# Altium schematic sheet dram.SchDoc
size A1; SheetNumber: 7; SheetTotal: 21
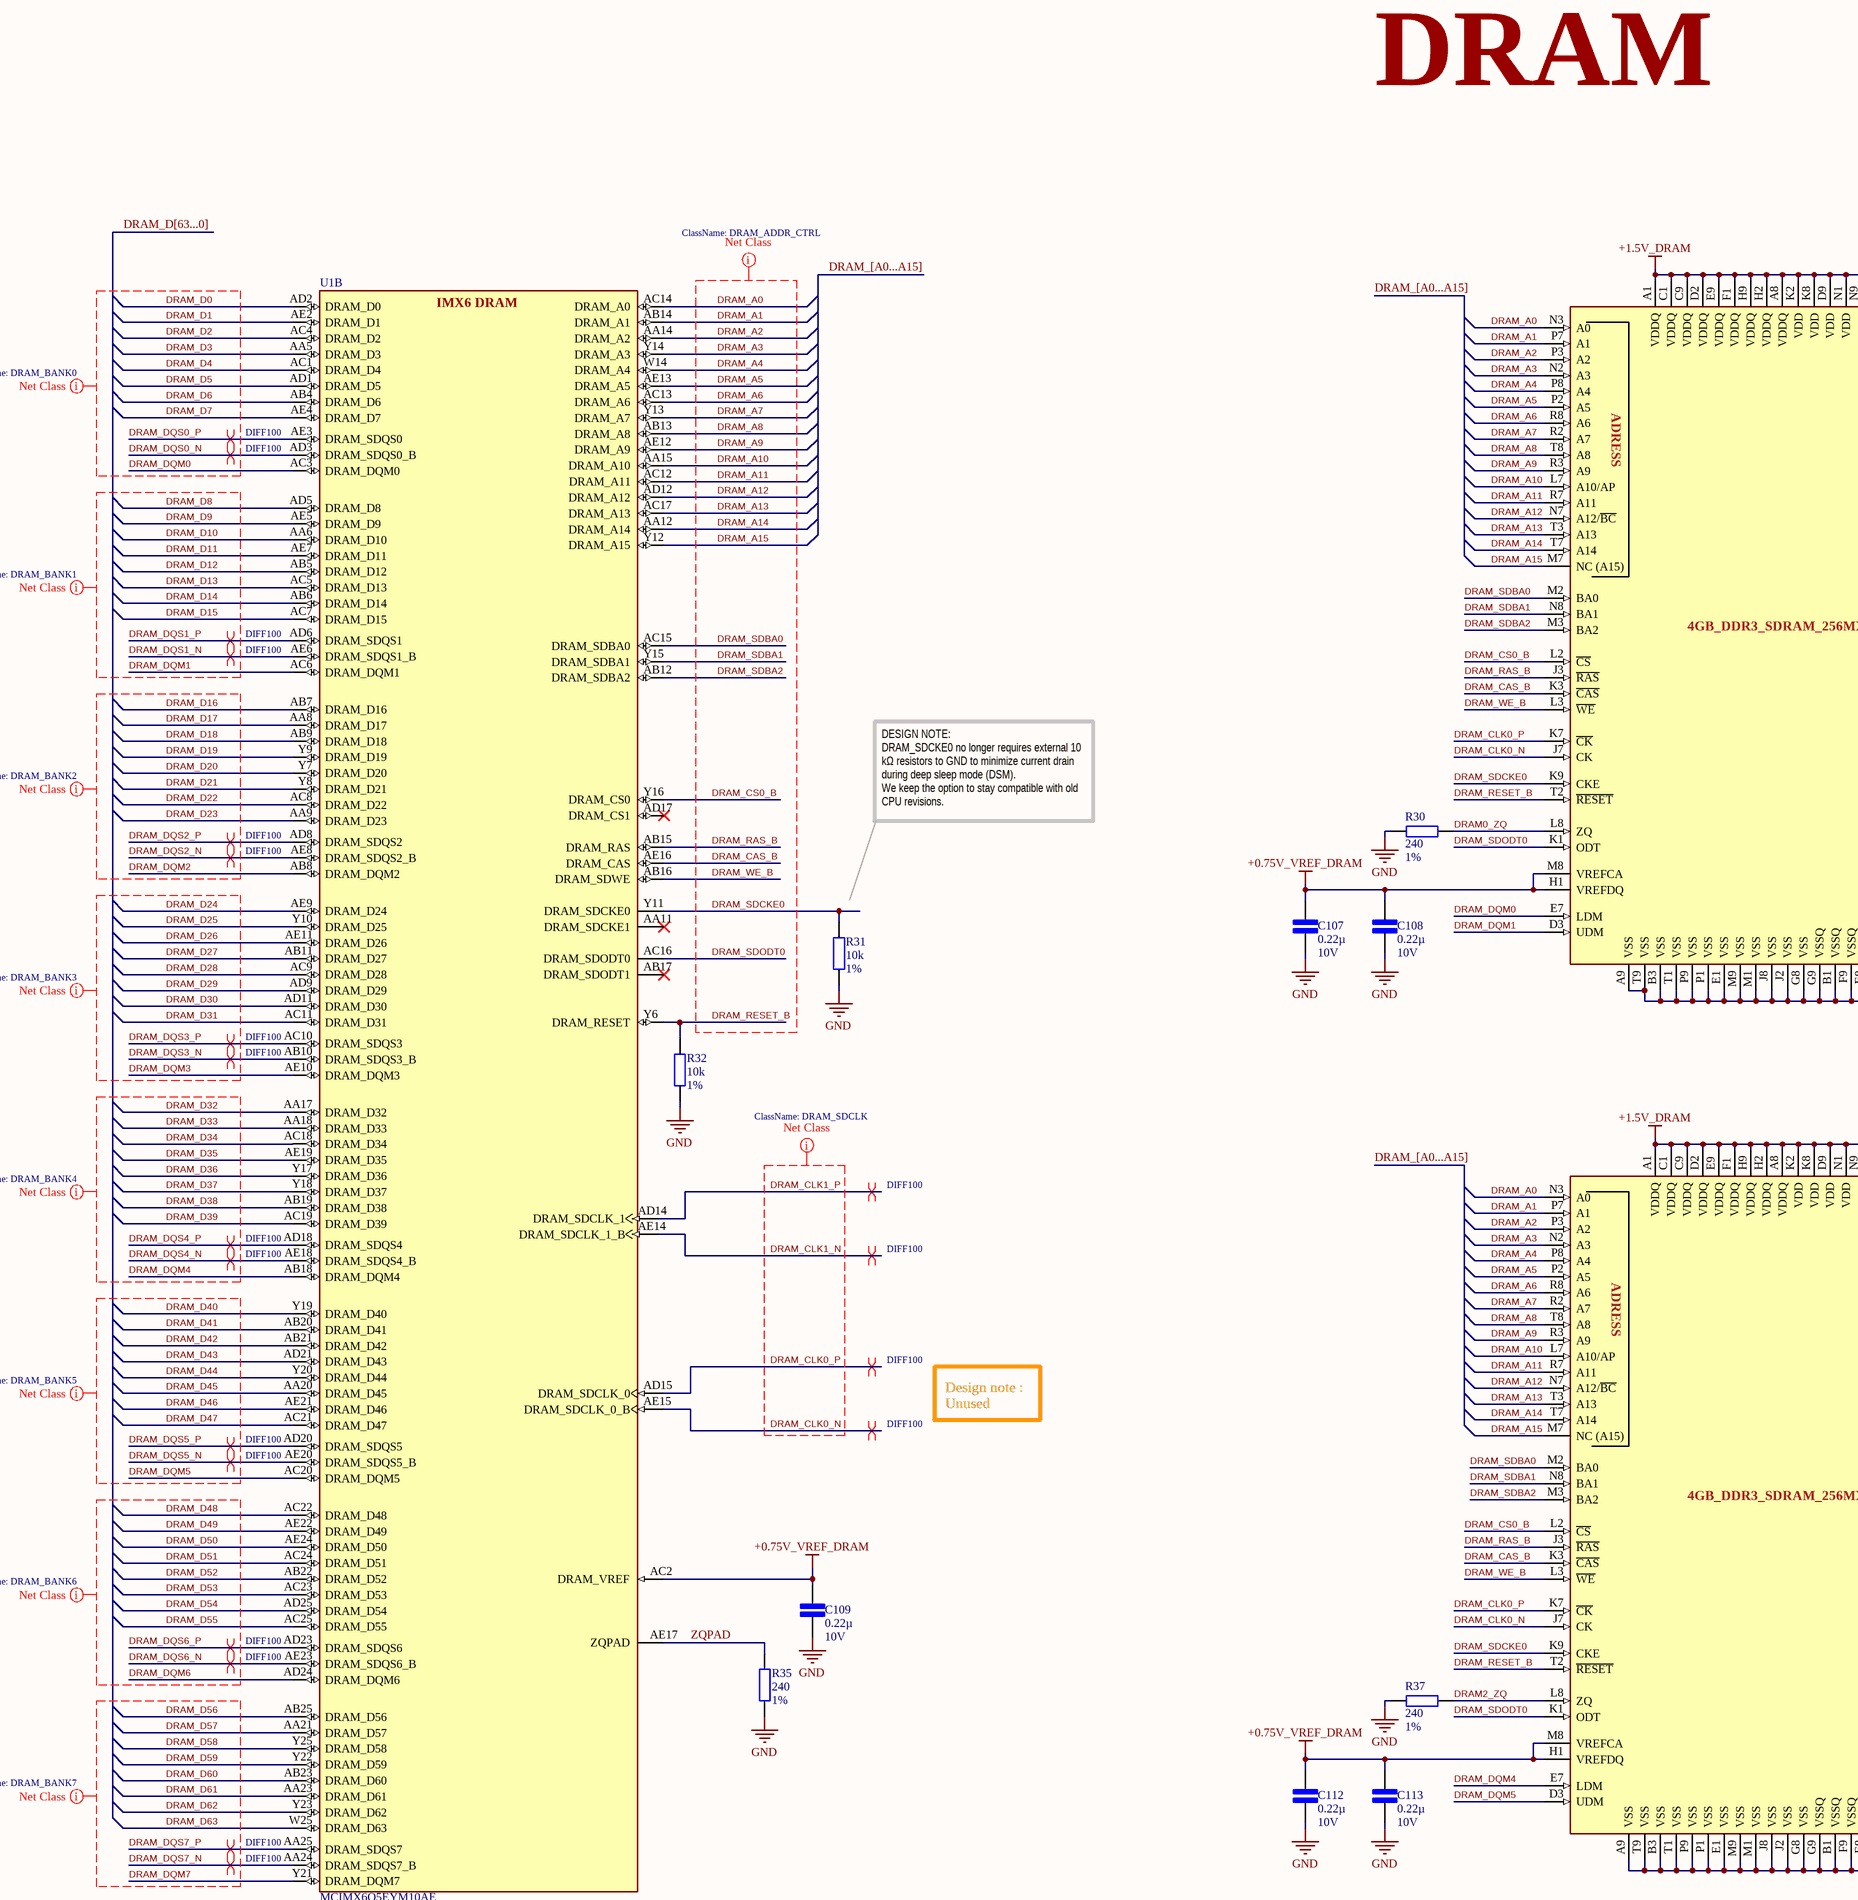
[diagram p0: dram.SchDoc, top left]
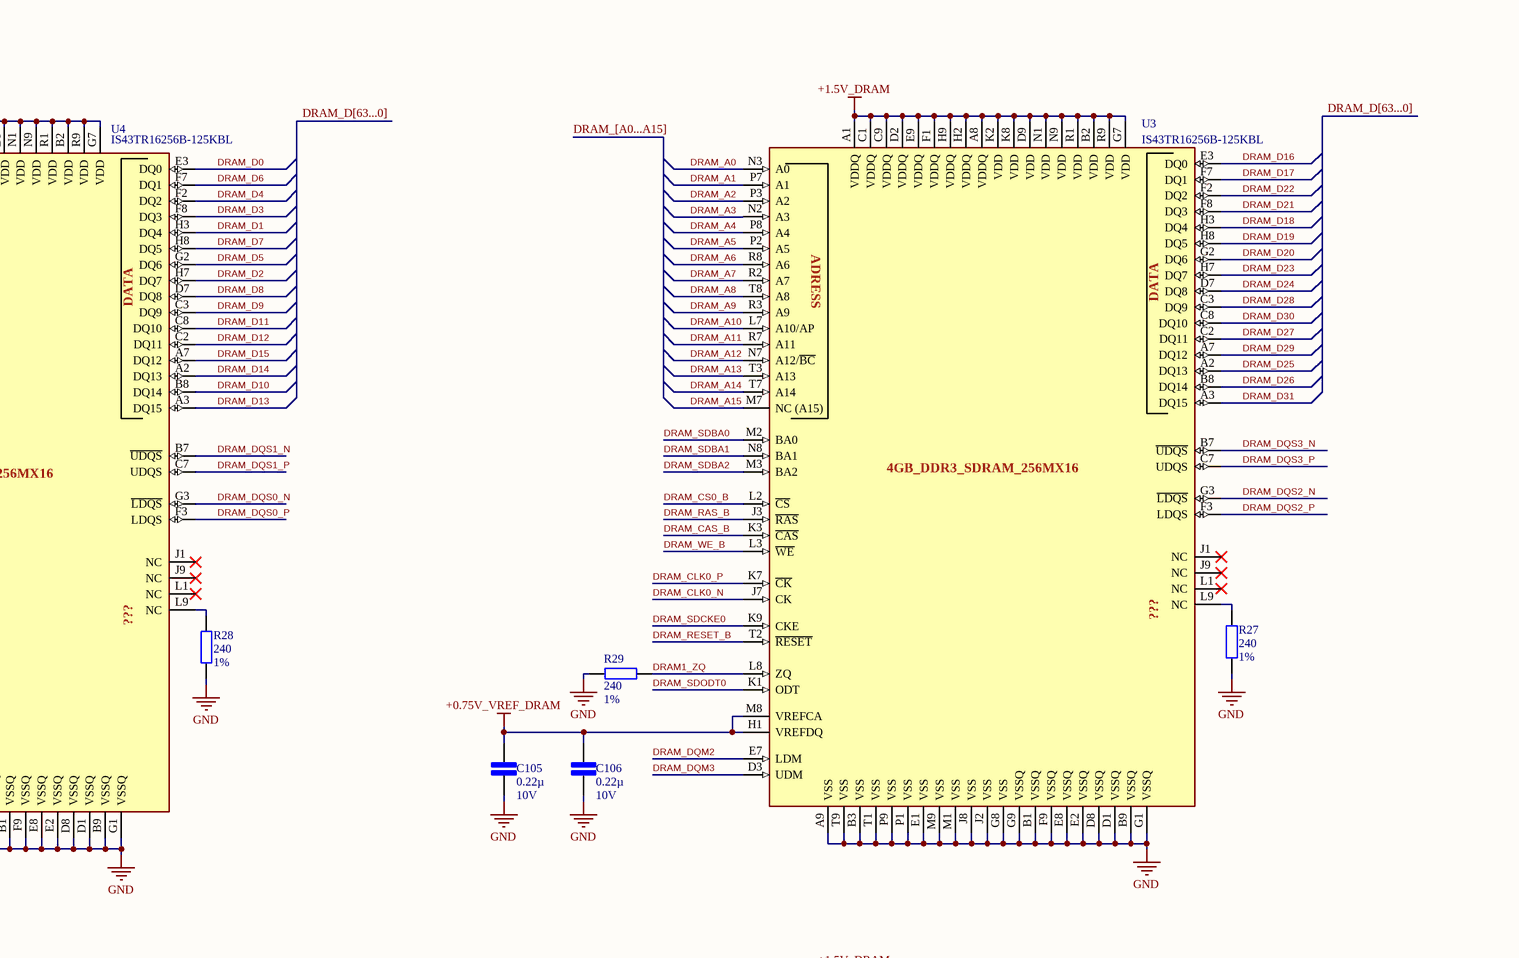
[diagram p1: dram.SchDoc, top right]
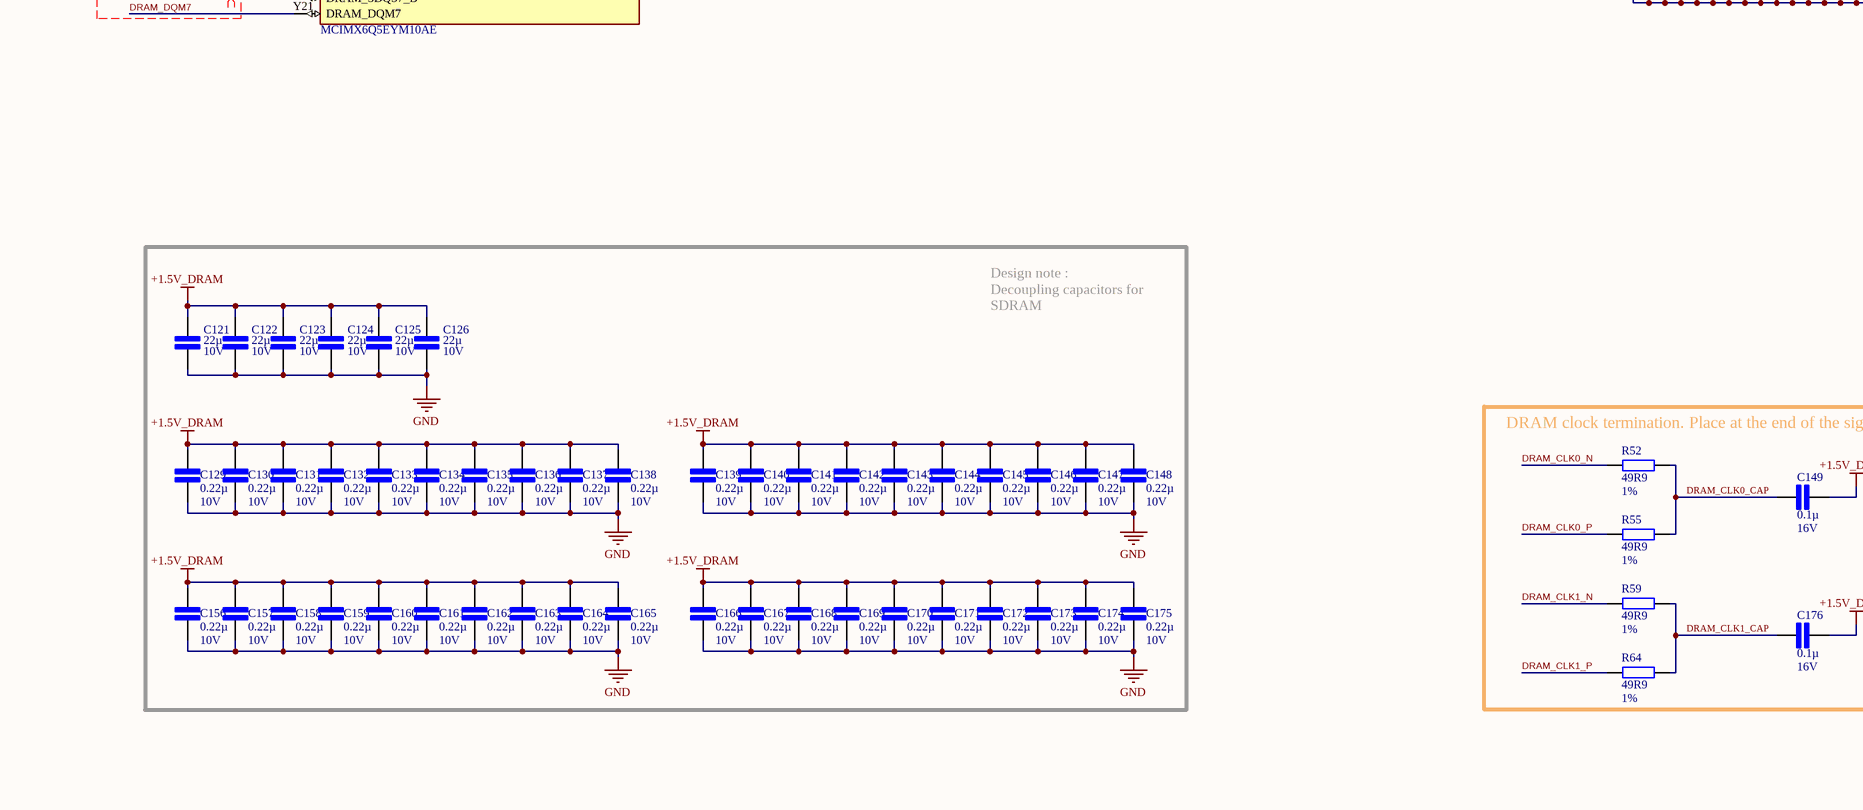
[diagram p2: dram.SchDoc, bottom left]
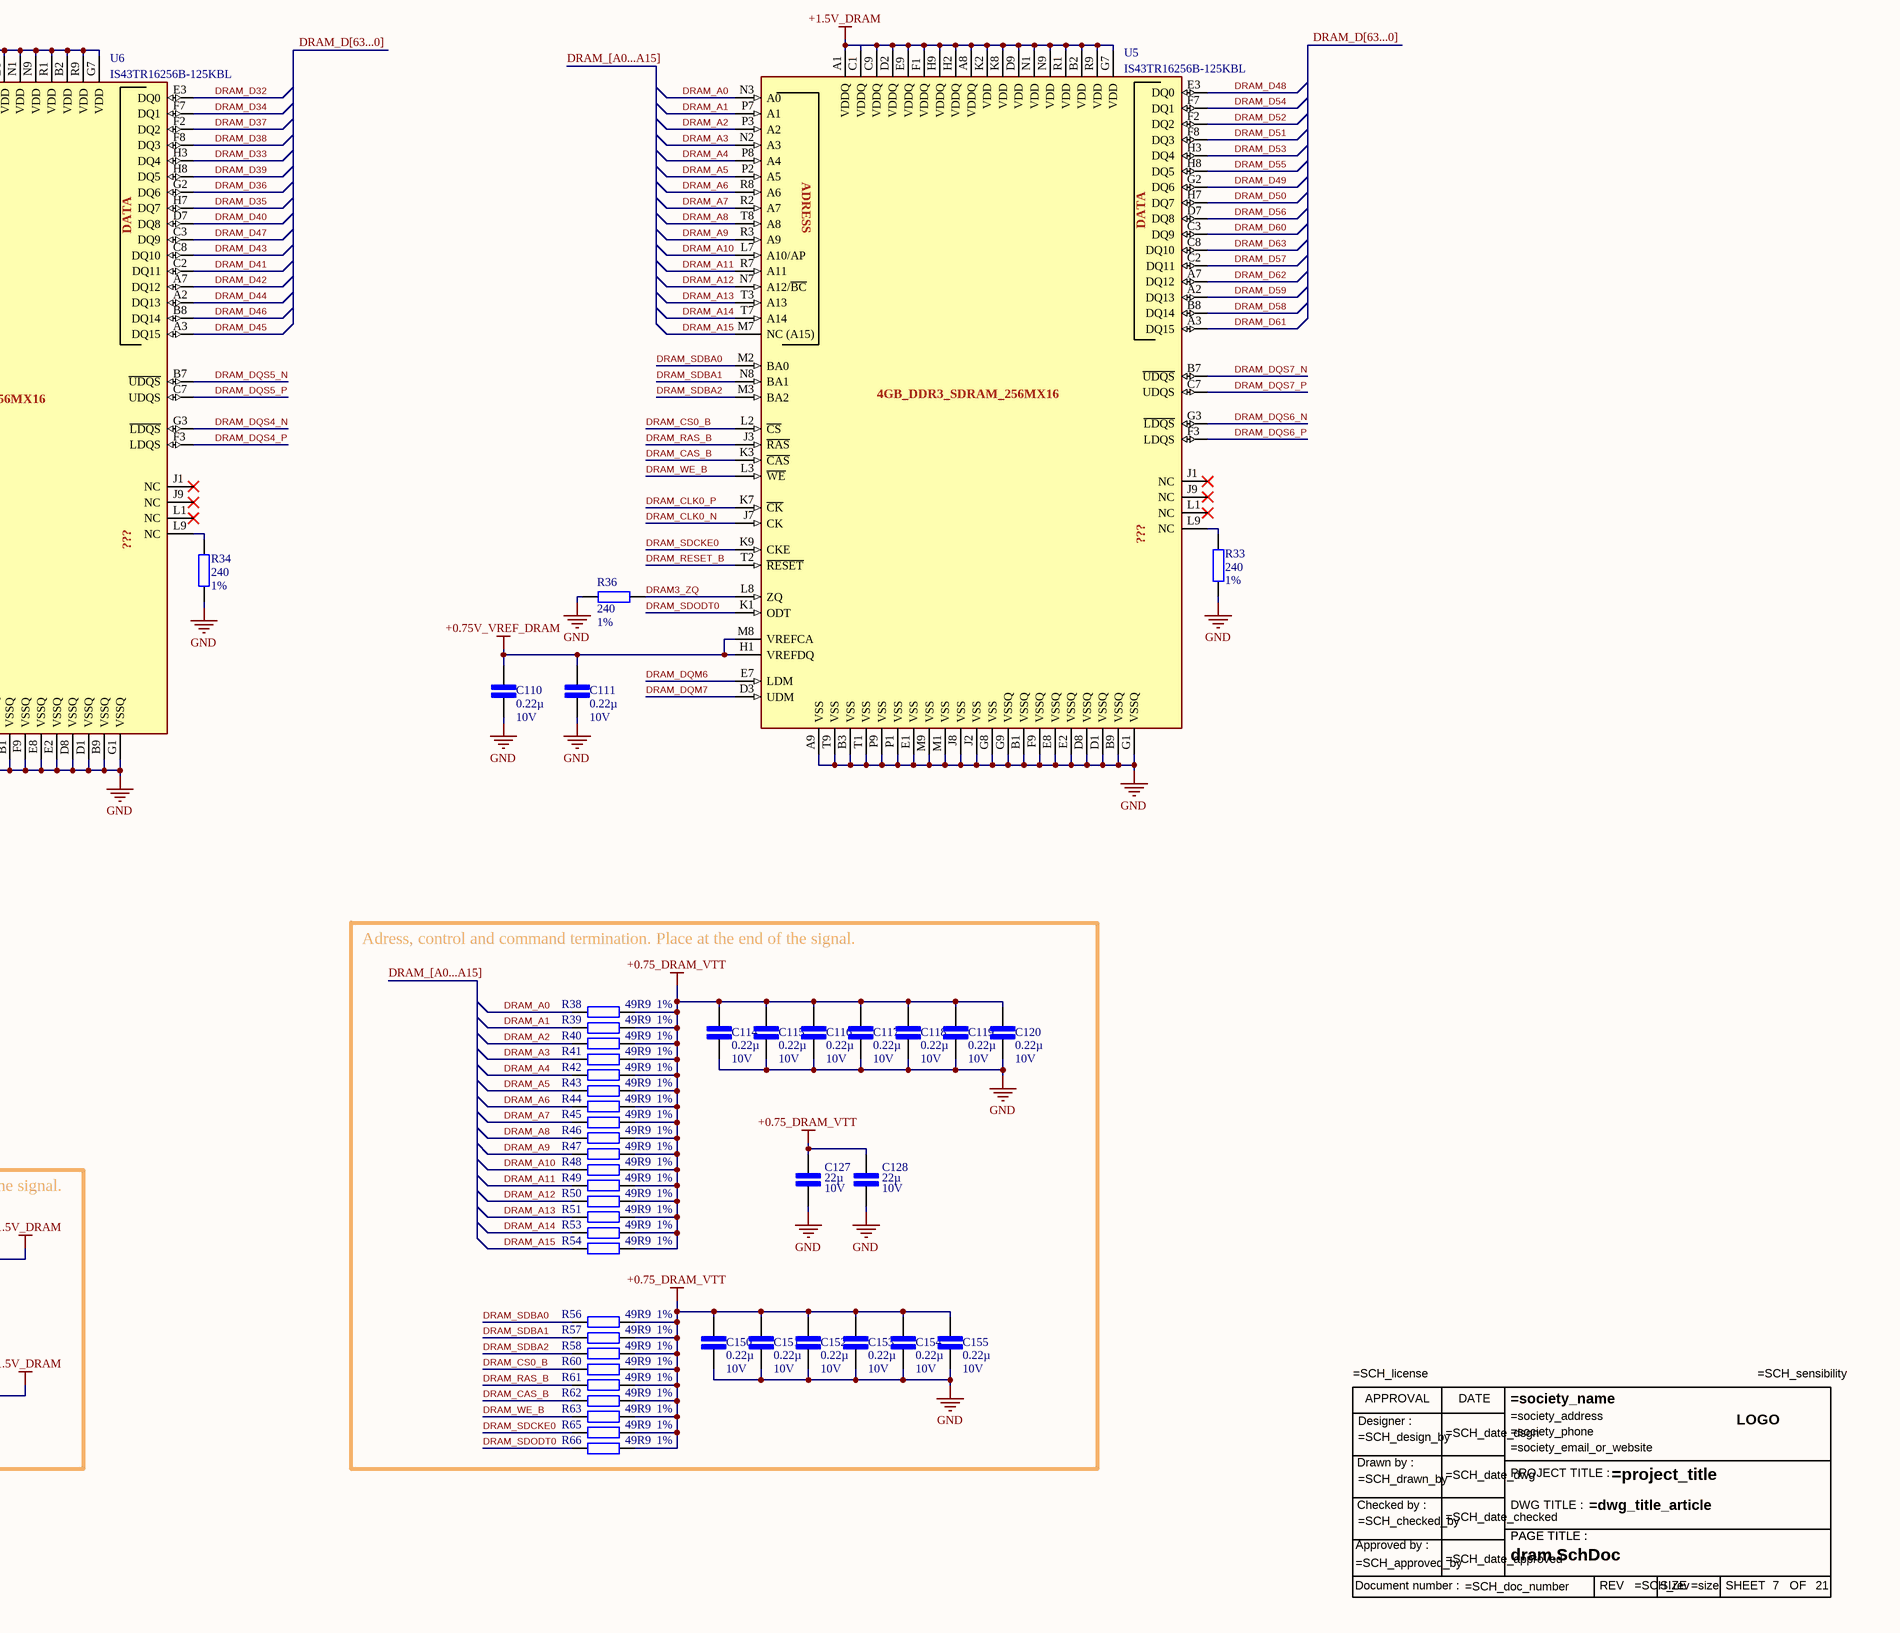
[diagram p3: dram.SchDoc, bottom right]

## Parts
C105  0.22µ  Tension du diélectrique: 10V  [Cap cer 0402/1005]
C106  0.22µ  Tension du diélectrique: 10V  [Cap cer 0402/1005]
C107  0.22µ  Tension du diélectrique: 10V  [Cap cer 0402/1005]
C108  0.22µ  Tension du diélectrique: 10V  [Cap cer 0402/1005]
C109  0.22µ  Tension du diélectrique: 10V  [Cap cer 0402/1005]
C110  0.22µ  Tension du diélectrique: 10V  [Cap cer 0402/1005]
C111  0.22µ  Tension du diélectrique: 10V  [Cap cer 0402/1005]
C112  0.22µ  Tension du diélectrique: 10V  [Cap cer 0402/1005]
C113  0.22µ  Tension du diélectrique: 10V  [Cap cer 0402/1005]
C114  0.22µ  Tension du diélectrique: 10V  [Cap cer 0402/1005]
C115  0.22µ  Tension du diélectrique: 10V  [Cap cer 0402/1005]
C116  0.22µ  Tension du diélectrique: 10V  [Cap cer 0402/1005]
C117  0.22µ  Tension du diélectrique: 10V  [Cap cer 0402/1005]
C118  0.22µ  Tension du diélectrique: 10V  [Cap cer 0402/1005]
C119  0.22µ  Tension du diélectrique: 10V  [Cap cer 0402/1005]
C120  0.22µ  Tension du diélectrique: 10V  [Cap cer 0402/1005]
C121  22µ  Tension du diélectrique: 10V  [Cap cer 0603/4608]
C122  22µ  Tension du diélectrique: 10V  [Cap cer 0603/4608]
C123  22µ  Tension du diélectrique: 10V  [Cap cer 0603/4608]
C124  22µ  Tension du diélectrique: 10V  [Cap cer 0603/4608]
C125  22µ  Tension du diélectrique: 10V  [Cap cer 0603/4608]
C126  22µ  Tension du diélectrique: 10V  [Cap cer 0603/4608]
C127  22µ  Tension du diélectrique: 10V  [Cap cer 0603/4608]
C128  22µ  Tension du diélectrique: 10V  [Cap cer 0603/4608]
C129  0.22µ  Tension du diélectrique: 10V  [Cap cer 0402/1005]
C130  0.22µ  Tension du diélectrique: 10V  [Cap cer 0402/1005]
C131  0.22µ  Tension du diélectrique: 10V  [Cap cer 0402/1005]
C132  0.22µ  Tension du diélectrique: 10V  [Cap cer 0402/1005]
C133  0.22µ  Tension du diélectrique: 10V  [Cap cer 0402/1005]
C134  0.22µ  Tension du diélectrique: 10V  [Cap cer 0402/1005]
C135  0.22µ  Tension du diélectrique: 10V  [Cap cer 0402/1005]
C136  0.22µ  Tension du diélectrique: 10V  [Cap cer 0402/1005]
C137  0.22µ  Tension du diélectrique: 10V  [Cap cer 0402/1005]
C138  0.22µ  Tension du diélectrique: 10V  [Cap cer 0402/1005]
C139  0.22µ  Tension du diélectrique: 10V  [Cap cer 0402/1005]
C140  0.22µ  Tension du diélectrique: 10V  [Cap cer 0402/1005]
C141  0.22µ  Tension du diélectrique: 10V  [Cap cer 0402/1005]
C142  0.22µ  Tension du diélectrique: 10V  [Cap cer 0402/1005]
C143  0.22µ  Tension du diélectrique: 10V  [Cap cer 0402/1005]
C144  0.22µ  Tension du diélectrique: 10V  [Cap cer 0402/1005]
C145  0.22µ  Tension du diélectrique: 10V  [Cap cer 0402/1005]
C146  0.22µ  Tension du diélectrique: 10V  [Cap cer 0402/1005]
C147  0.22µ  Tension du diélectrique: 10V  [Cap cer 0402/1005]
C148  0.22µ  Tension du diélectrique: 10V  [Cap cer 0402/1005]
C149  0.1µ  Tension du diélectrique: 16V  [Cap cer 0402/1005]
C150  0.22µ  Tension du diélectrique: 10V  [Cap cer 0402/1005]
C151  0.22µ  Tension du diélectrique: 10V  [Cap cer 0402/1005]
C152  0.22µ  Tension du diélectrique: 10V  [Cap cer 0402/1005]
C153  0.22µ  Tension du diélectrique: 10V  [Cap cer 0402/1005]
C154  0.22µ  Tension du diélectrique: 10V  [Cap cer 0402/1005]
C155  0.22µ  Tension du diélectrique: 10V  [Cap cer 0402/1005]
C156  0.22µ  Tension du diélectrique: 10V  [Cap cer 0402/1005]
C157  0.22µ  Tension du diélectrique: 10V  [Cap cer 0402/1005]
C158  0.22µ  Tension du diélectrique: 10V  [Cap cer 0402/1005]
C159  0.22µ  Tension du diélectrique: 10V  [Cap cer 0402/1005]
C160  0.22µ  Tension du diélectrique: 10V  [Cap cer 0402/1005]
C161  0.22µ  Tension du diélectrique: 10V  [Cap cer 0402/1005]
C162  0.22µ  Tension du diélectrique: 10V  [Cap cer 0402/1005]
C163  0.22µ  Tension du diélectrique: 10V  [Cap cer 0402/1005]
C164  0.22µ  Tension du diélectrique: 10V  [Cap cer 0402/1005]
C165  0.22µ  Tension du diélectrique: 10V  [Cap cer 0402/1005]
C166  0.22µ  Tension du diélectrique: 10V  [Cap cer 0402/1005]
C167  0.22µ  Tension du diélectrique: 10V  [Cap cer 0402/1005]
C168  0.22µ  Tension du diélectrique: 10V  [Cap cer 0402/1005]
C169  0.22µ  Tension du diélectrique: 10V  [Cap cer 0402/1005]
C170  0.22µ  Tension du diélectrique: 10V  [Cap cer 0402/1005]
C171  0.22µ  Tension du diélectrique: 10V  [Cap cer 0402/1005]
C172  0.22µ  Tension du diélectrique: 10V  [Cap cer 0402/1005]
C173  0.22µ  Tension du diélectrique: 10V  [Cap cer 0402/1005]
C174  0.22µ  Tension du diélectrique: 10V  [Cap cer 0402/1005]
C175  0.22µ  Tension du diélectrique: 10V  [Cap cer 0402/1005]
C176  0.1µ  Tension du diélectrique: 16V  [Cap cer 0402/1005]
R27  240  pourcentage: 1%  [Res 0402/1005]
R28  240  pourcentage: 1%  [Res 0402/1005]
R29  240  pourcentage: 1%  [Res 0402/1005]
R30  240  pourcentage: 1%  [Res 0402/1005]
R31  10k  pourcentage: 1%  [Res 0402/1005]
R32  10k  pourcentage: 1%  [Res 0402/1005]
R33  240  pourcentage: 1%  [Res 0402/1005]
R34  240  pourcentage: 1%  [Res 0402/1005]
R35  240  pourcentage: 1%  [Res 0402/1005]
R36  240  pourcentage: 1%  [Res 0402/1005]
R37  240  pourcentage: 1%  [Res 0402/1005]
R38  49R9  pourcentage: 1%  [Res 0402/1005]
R39  49R9  pourcentage: 1%  [Res 0402/1005]
R40  49R9  pourcentage: 1%  [Res 0402/1005]
R41  49R9  pourcentage: 1%  [Res 0402/1005]
R42  49R9  pourcentage: 1%  [Res 0402/1005]
R43  49R9  pourcentage: 1%  [Res 0402/1005]
R44  49R9  pourcentage: 1%  [Res 0402/1005]
R45  49R9  pourcentage: 1%  [Res 0402/1005]
R46  49R9  pourcentage: 1%  [Res 0402/1005]
R47  49R9  pourcentage: 1%  [Res 0402/1005]
R48  49R9  pourcentage: 1%  [Res 0402/1005]
R49  49R9  pourcentage: 1%  [Res 0402/1005]
R50  49R9  pourcentage: 1%  [Res 0402/1005]
R51  49R9  pourcentage: 1%  [Res 0402/1005]
R52  49R9  pourcentage: 1%  [Res 0402/1005]
R53  49R9  pourcentage: 1%  [Res 0402/1005]
R54  49R9  pourcentage: 1%  [Res 0402/1005]
R55  49R9  pourcentage: 1%  [Res 0402/1005]
R56  49R9  pourcentage: 1%  [Res 0402/1005]
R57  49R9  pourcentage: 1%  [Res 0402/1005]
R58  49R9  pourcentage: 1%  [Res 0402/1005]
R59  49R9  pourcentage: 1%  [Res 0402/1005]
R60  49R9  pourcentage: 1%  [Res 0402/1005]
R61  49R9  pourcentage: 1%  [Res 0402/1005]
R62  49R9  pourcentage: 1%  [Res 0402/1005]
R63  49R9  pourcentage: 1%  [Res 0402/1005]
R64  49R9  pourcentage: 1%  [Res 0402/1005]
R65  49R9  pourcentage: 1%  [Res 0402/1005]
R66  49R9  pourcentage: 1%  [Res 0402/1005]
TB5  Title bloc ANSI modified  (value not drawn)
U1  MCIMX6Q5EYM10AE  [FRES-2197-01]  (part B of 21)
U3  IS43TR16256B-125KBL  [BGA-96 DDR3]
U4  IS43TR16256B-125KBL  [BGA-96 DDR3]
U5  IS43TR16256B-125KBL  [BGA-96 DDR3]
U6  IS43TR16256B-125KBL  [BGA-96 DDR3]

## Blocks framed on the sheet
DRAM clock termination. Place at the end of the signal.: C149 C176 R52 R55 R59 R64

## Nets
+0.75_DRAM_VTT: C114.1 C115.1 C116.1 C117.1 C118.1 C119.1 C120.1 C127.1 C128.1 C150.1 C151.1 C152.1 C153.1 C154.1 C155.1 R38.2 R39.2 R40.2 R41.2 R42.2 R43.2 R44.2 R45.2 R46.2 R47.2 R48.2 R49.2 R50.2 R51.2 R53.2 R54.2 R56.2 R57.2 R58.2 R60.2 R61.2 R62.2 R63.2 R65.2 R66.2
+0.75V_VREF_DRAM: C105.1 C106.1 C107.1 C108.1 C109.1 C110.1 C111.1 C112.1 C113.1 U1.AC2(DRAM_VREF) U3.H1(VREFDQ) U3.M8(VREFCA) U4.H1(VREFDQ) U4.M8(VREFCA) U5.H1(VREFDQ) U5.M8(VREFCA) U6.H1(VREFDQ) U6.M8(VREFCA)
+1.5V_DRAM: C121.1 C122.1 C123.1 C124.1 C125.1 C126.1 C129.1 C130.1 C131.1 C132.1 C133.1 C134.1 C135.1 C136.1 C137.1 C138.1 C139.1 C140.1 C141.1 C142.1 C143.1 C144.1 C145.1 C146.1 C147.1 C148.1 C149.2 C156.1 C157.1 C158.1 C159.1 C160.1 C161.1 C162.1 C163.1 C164.1 C165.1 C166.1 C167.1 C168.1 C169.1 C170.1 C171.1 C172.1 C173.1 C174.1 C175.1 C176.2 U3.A1(VDDQ) U3.A8(VDDQ) U3.B2(VDD) U3.C1(VDDQ) U3.C9(VDDQ) U3.D2(VDDQ) U3.D9(VDD) U3.E9(VDDQ) U3.F1(VDDQ) U3.G7(VDD) U3.H2(VDDQ) U3.H9(VDDQ) U3.K2(VDD) U3.K8(VDD) U3.N1(VDD) U3.N9(VDD) U3.R1(VDD) U3.R9(VDD) U4.A1(VDDQ) U4.A8(VDDQ) U4.B2(VDD) U4.C1(VDDQ) U4.C9(VDDQ) U4.D2(VDDQ) U4.D9(VDD) U4.E9(VDDQ) U4.F1(VDDQ) U4.G7(VDD) U4.H2(VDDQ) U4.H9(VDDQ) U4.K2(VDD) U4.K8(VDD) U4.N1(VDD) U4.N9(VDD) U4.R1(VDD) U4.R9(VDD) U5.A1(VDDQ) U5.A8(VDDQ) U5.B2(VDD) U5.C1(VDDQ) U5.C9(VDDQ) U5.D2(VDDQ) U5.D9(VDD) U5.E9(VDDQ) U5.F1(VDDQ) U5.G7(VDD) U5.H2(VDDQ) U5.H9(VDDQ) U5.K2(VDD) U5.K8(VDD) U5.N1(VDD) U5.N9(VDD) U5.R1(VDD) U5.R9(VDD) U6.A1(VDDQ) U6.A8(VDDQ) U6.B2(VDD) U6.C1(VDDQ) U6.C9(VDDQ) U6.D2(VDDQ) U6.D9(VDD) U6.E9(VDDQ) U6.F1(VDDQ) U6.G7(VDD) U6.H2(VDDQ) U6.H9(VDDQ) U6.K2(VDD) U6.K8(VDD) U6.N1(VDD) U6.N9(VDD) U6.R1(VDD) U6.R9(VDD)
GND: C105.2 C106.2 C107.2 C108.2 C109.2 C110.2 C111.2 C112.2 C113.2 C114.2 C115.2 C116.2 C117.2 C118.2 C119.2 C120.2 C121.2 C122.2 C123.2 C124.2 C125.2 C126.2 C127.2 C128.2 C129.2 C130.2 C131.2 C132.2 C133.2 C134.2 C135.2 C136.2 C137.2 C138.2 C139.2 C140.2 C141.2 C142.2 C143.2 C144.2 C145.2 C146.2 C147.2 C148.2 C150.2 C151.2 C152.2 C153.2 C154.2 C155.2 C156.2 C157.2 C158.2 C159.2 C160.2 C161.2 C162.2 C163.2 C164.2 C165.2 C166.2 C167.2 C168.2 C169.2 C170.2 C171.2 C172.2 C173.2 C174.2 C175.2 R27.1 R28.1 R29.1 R30.1 R31.1 R32.1 R33.1 R34.1 R35.1 R36.1 R37.1 U3.A9(VSS) U3.B1(VSSQ) U3.B3(VSS) U3.B9(VSSQ) U3.D1(VSSQ) U3.D8(VSSQ) U3.E1(VSS) U3.E2(VSSQ) U3.E8(VSSQ) U3.F9(VSSQ) U3.G1(VSSQ) U3.G8(VSS) U3.G9(VSSQ) U3.J2(VSS) U3.J8(VSS) U3.M1(VSS) U3.M9(VSS) U3.P1(VSS) U3.P9(VSS) U3.T1(VSS) U3.T9(VSS) U4.A9(VSS) U4.B1(VSSQ) U4.B3(VSS) U4.B9(VSSQ) U4.D1(VSSQ) U4.D8(VSSQ) U4.E1(VSS) U4.E2(VSSQ) U4.E8(VSSQ) U4.F9(VSSQ) U4.G1(VSSQ) U4.G8(VSS) U4.G9(VSSQ) U4.J2(VSS) U4.J8(VSS) U4.M1(VSS) U4.M9(VSS) U4.P1(VSS) U4.P9(VSS) U4.T1(VSS) U4.T9(VSS) U5.A9(VSS) U5.B1(VSSQ) U5.B3(VSS) U5.B9(VSSQ) U5.D1(VSSQ) U5.D8(VSSQ) U5.E1(VSS) U5.E2(VSSQ) U5.E8(VSSQ) U5.F9(VSSQ) U5.G1(VSSQ) U5.G8(VSS) U5.G9(VSSQ) U5.J2(VSS) U5.J8(VSS) U5.M1(VSS) U5.M9(VSS) U5.P1(VSS) U5.P9(VSS) U5.T1(VSS) U5.T9(VSS) U6.A9(VSS) U6.B1(VSSQ) U6.B3(VSS) U6.B9(VSSQ) U6.D1(VSSQ) U6.D8(VSSQ) U6.E1(VSS) U6.E2(VSSQ) U6.E8(VSSQ) U6.F9(VSSQ) U6.G1(VSSQ) U6.G8(VSS) U6.G9(VSSQ) U6.J2(VSS) U6.J8(VSS) U6.M1(VSS) U6.M9(VSS) U6.P1(VSS) U6.P9(VSS) U6.T1(VSS) U6.T9(VSS)
DRAM0_ZQ: R30.2 U4.L8(ZQ)
DRAM1_ZQ: R29.2 U3.L8(ZQ)
DRAM2_ZQ: R37.2 U6.L8(ZQ)
DRAM3_ZQ: R36.2 U5.L8(ZQ)
DRAM_A0: R38.1 U1.AC14(DRAM_A0) U3.N3(A0) U4.N3(A0) U5.N3(A0) U6.N3(A0)
DRAM_A1: R39.1 U1.AB14(DRAM_A1) U3.P7(A1) U4.P7(A1) U5.P7(A1) U6.P7(A1)
DRAM_A2: R40.1 U1.AA14(DRAM_A2) U3.P3(A2) U4.P3(A2) U5.P3(A2) U6.P3(A2)
DRAM_A3: R41.1 U1.Y14(DRAM_A3) U3.N2(A3) U4.N2(A3) U5.N2(A3) U6.N2(A3)
DRAM_A4: R42.1 U1.W14(DRAM_A4) U3.P8(A4) U4.P8(A4) U5.P8(A4) U6.P8(A4)
DRAM_A5: R43.1 U1.AE13(DRAM_A5) U3.P2(A5) U4.P2(A5) U5.P2(A5) U6.P2(A5)
DRAM_A6: R44.1 U1.AC13(DRAM_A6) U3.R8(A6) U4.R8(A6) U5.R8(A6) U6.R8(A6)
DRAM_A7: R45.1 U1.Y13(DRAM_A7) U3.R2(A7) U4.R2(A7) U5.R2(A7) U6.R2(A7)
DRAM_A8: R46.1 U1.AB13(DRAM_A8) U3.T8(A8) U4.T8(A8) U5.T8(A8) U6.T8(A8)
DRAM_A9: R47.1 U1.AE12(DRAM_A9) U3.R3(A9) U4.R3(A9) U5.R3(A9) U6.R3(A9)
DRAM_A10: R48.1 U1.AA15(DRAM_A10) U3.L7(A10/AP) U4.L7(A10/AP) U5.L7(A10/AP) U6.L7(A10/AP)
DRAM_A11: R49.1 U1.AC12(DRAM_A11) U3.R7(A11) U4.R7(A11) U5.R7(A11) U6.R7(A11)
DRAM_A12: R50.1 U1.AD12(DRAM_A12) U3.N7(A12/~{BC}) U4.N7(A12/~{BC}) U5.N7(A12/~{BC}) U6.N7(A12/~{BC})
DRAM_A13: R51.1 U1.AC17(DRAM_A13) U3.T3(A13) U4.T3(A13) U5.T3(A13) U6.T3(A13)
DRAM_A14: R53.1 U1.AA12(DRAM_A14) U3.T7(A14) U4.T7(A14) U5.T7(A14) U6.T7(A14)
DRAM_A15: R54.1 U1.Y12(DRAM_A15) U3.M7(NC_(A15)) U4.M7(NC_(A15)) U5.M7(NC_(A15)) U6.M7(NC_(A15))
DRAM_CAS_B: R62.1 U1.AE16(DRAM_CAS) U3.K3(~{CAS}) U4.K3(~{CAS}) U5.K3(~{CAS}) U6.K3(~{CAS})
DRAM_CLK0_CAP: C149.1 R52.2 R55.2
DRAM_CLK0_N: R52.1 U1.AE15(DRAM_SDCLK_0_B) U3.J7(CK) U4.J7(CK) U5.J7(CK) U6.J7(CK)
DRAM_CLK0_P: R55.1 U1.AD15(DRAM_SDCLK_0) U3.K7(~{CK}) U4.K7(~{CK}) U5.K7(~{CK}) U6.K7(~{CK})
DRAM_CLK1_CAP: C176.1 R59.2 R64.2
DRAM_CLK1_N: R59.1 U1.AE14(DRAM_SDCLK_1_B)
DRAM_CLK1_P: R64.1 U1.AD14(DRAM_SDCLK_1)
DRAM_CS0_B: R60.1 U1.Y16(DRAM_CS0) U3.L2(~{CS}) U4.L2(~{CS}) U5.L2(~{CS}) U6.L2(~{CS})
DRAM_D0: U1.AD2(DRAM_D0) U4.E3(DQ0)
DRAM_D1: U1.AE2(DRAM_D1) U4.H3(DQ4)
DRAM_D2: U1.AC4(DRAM_D2) U4.H7(DQ7)
DRAM_D3: U1.AA5(DRAM_D3) U4.F8(DQ3)
DRAM_D4: U1.AC1(DRAM_D4) U4.F2(DQ2)
DRAM_D5: U1.AD1(DRAM_D5) U4.G2(DQ6)
DRAM_D6: U1.AB4(DRAM_D6) U4.F7(DQ1)
DRAM_D7: U1.AE4(DRAM_D7) U4.H8(DQ5)
DRAM_D8: U1.AD5(DRAM_D8) U4.D7(DQ8)
DRAM_D9: U1.AE5(DRAM_D9) U4.C3(DQ9)
DRAM_D10: U1.AA6(DRAM_D10) U4.B8(DQ14)
DRAM_D11: U1.AE7(DRAM_D11) U4.C8(DQ10)
DRAM_D12: U1.AB5(DRAM_D12) U4.C2(DQ11)
DRAM_D13: U1.AC5(DRAM_D13) U4.A3(DQ15)
DRAM_D14: U1.AB6(DRAM_D14) U4.A2(DQ13)
DRAM_D15: U1.AC7(DRAM_D15) U4.A7(DQ12)
DRAM_D16: U1.AB7(DRAM_D16) U3.E3(DQ0)
DRAM_D17: U1.AA8(DRAM_D17) U3.F7(DQ1)
DRAM_D18: U1.AB9(DRAM_D18) U3.H3(DQ4)
DRAM_D19: U1.Y9(DRAM_D19) U3.H8(DQ5)
DRAM_D20: U1.Y7(DRAM_D20) U3.G2(DQ6)
DRAM_D21: U1.Y8(DRAM_D21) U3.F8(DQ3)
DRAM_D22: U1.AC8(DRAM_D22) U3.F2(DQ2)
DRAM_D23: U1.AA9(DRAM_D23) U3.H7(DQ7)
DRAM_D24: U1.AE9(DRAM_D24) U3.D7(DQ8)
DRAM_D25: U1.Y10(DRAM_D25) U3.A2(DQ13)
DRAM_D26: U1.AE11(DRAM_D26) U3.B8(DQ14)
DRAM_D27: U1.AB11(DRAM_D27) U3.C2(DQ11)
DRAM_D28: U1.AC9(DRAM_D28) U3.C3(DQ9)
DRAM_D29: U1.AD9(DRAM_D29) U3.A7(DQ12)
DRAM_D30: U1.AD11(DRAM_D30) U3.C8(DQ10)
DRAM_D31: U1.AC11(DRAM_D31) U3.A3(DQ15)
DRAM_D32: U1.AA17(DRAM_D32) U6.E3(DQ0)
DRAM_D33: U1.AA18(DRAM_D33) U6.H3(DQ4)
DRAM_D34: U1.AC18(DRAM_D34) U6.F7(DQ1)
DRAM_D35: U1.AE19(DRAM_D35) U6.H7(DQ7)
DRAM_D36: U1.Y17(DRAM_D36) U6.G2(DQ6)
DRAM_D37: U1.Y18(DRAM_D37) U6.F2(DQ2)
DRAM_D38: U1.AB19(DRAM_D38) U6.F8(DQ3)
DRAM_D39: U1.AC19(DRAM_D39) U6.H8(DQ5)
DRAM_D40: U1.Y19(DRAM_D40) U6.D7(DQ8)
DRAM_D41: U1.AB20(DRAM_D41) U6.C2(DQ11)
DRAM_D42: U1.AB21(DRAM_D42) U6.A7(DQ12)
DRAM_D43: U1.AD21(DRAM_D43) U6.C8(DQ10)
DRAM_D44: U1.Y20(DRAM_D44) U6.A2(DQ13)
DRAM_D45: U1.AA20(DRAM_D45) U6.A3(DQ15)
DRAM_D46: U1.AE21(DRAM_D46) U6.B8(DQ14)
DRAM_D47: U1.AC21(DRAM_D47) U6.C3(DQ9)
DRAM_D48: U1.AC22(DRAM_D48) U5.E3(DQ0)
DRAM_D49: U1.AE22(DRAM_D49) U5.G2(DQ6)
DRAM_D50: U1.AE24(DRAM_D50) U5.H7(DQ7)
DRAM_D51: U1.AC24(DRAM_D51) U5.F8(DQ3)
DRAM_D52: U1.AB22(DRAM_D52) U5.F2(DQ2)
DRAM_D53: U1.AC23(DRAM_D53) U5.H3(DQ4)
DRAM_D54: U1.AD25(DRAM_D54) U5.F7(DQ1)
DRAM_D55: U1.AC25(DRAM_D55) U5.H8(DQ5)
DRAM_D56: U1.AB25(DRAM_D56) U5.D7(DQ8)
DRAM_D57: U1.AA21(DRAM_D57) U5.C2(DQ11)
DRAM_D58: U1.Y25(DRAM_D58) U5.B8(DQ14)
DRAM_D59: U1.Y22(DRAM_D59) U5.A2(DQ13)
DRAM_D60: U1.AB23(DRAM_D60) U5.C3(DQ9)
DRAM_D61: U1.AA23(DRAM_D61) U5.A3(DQ15)
DRAM_D62: U1.Y23(DRAM_D62) U5.A7(DQ12)
DRAM_D63: U1.W25(DRAM_D63) U5.C8(DQ10)
DRAM_DQM0: U1.AC3(DRAM_DQM0) U4.E7(LDM)
DRAM_DQM1: U1.AC6(DRAM_DQM1) U4.D3(UDM)
DRAM_DQM2: U1.AB8(DRAM_DQM2) U3.E7(LDM)
DRAM_DQM3: U1.AE10(DRAM_DQM3) U3.D3(UDM)
DRAM_DQM4: U1.AB18(DRAM_DQM4) U6.E7(LDM)
DRAM_DQM5: U1.AC20(DRAM_DQM5) U6.D3(UDM)
DRAM_DQM6: U1.AD24(DRAM_DQM6) U5.E7(LDM)
DRAM_DQM7: U1.Y21(DRAM_DQM7) U5.D3(UDM)
DRAM_DQS0_N: U1.AD3(DRAM_SDQS0_B) U4.G3(~{LDQS})
DRAM_DQS0_P: U1.AE3(DRAM_SDQS0) U4.F3(LDQS)
DRAM_DQS1_N: U1.AE6(DRAM_SDQS1_B) U4.B7(~{UDQS})
DRAM_DQS1_P: U1.AD6(DRAM_SDQS1) U4.C7(UDQS)
DRAM_DQS2_N: U1.AE8(DRAM_SDQS2_B) U3.G3(~{LDQS})
DRAM_DQS2_P: U1.AD8(DRAM_SDQS2) U3.F3(LDQS)
DRAM_DQS3_N: U1.AB10(DRAM_SDQS3_B) U3.B7(~{UDQS})
DRAM_DQS3_P: U1.AC10(DRAM_SDQS3) U3.C7(UDQS)
DRAM_DQS4_N: U1.AE18(DRAM_SDQS4_B) U6.G3(~{LDQS})
DRAM_DQS4_P: U1.AD18(DRAM_SDQS4) U6.F3(LDQS)
DRAM_DQS5_N: U1.AE20(DRAM_SDQS5_B) U6.B7(~{UDQS})
DRAM_DQS5_P: U1.AD20(DRAM_SDQS5) U6.C7(UDQS)
DRAM_DQS6_N: U1.AE23(DRAM_SDQS6_B) U5.G3(~{LDQS})
DRAM_DQS6_P: U1.AD23(DRAM_SDQS6) U5.F3(LDQS)
DRAM_DQS7_N: U1.AA24(DRAM_SDQS7_B) U5.B7(~{UDQS})
DRAM_DQS7_P: U1.AA25(DRAM_SDQS7) U5.C7(UDQS)
DRAM_RAS_B: R61.1 U1.AB15(DRAM_RAS) U3.J3(~{RAS}) U4.J3(~{RAS}) U5.J3(~{RAS}) U6.J3(~{RAS})
DRAM_RESET_B: R32.2 U1.Y6(DRAM_RESET) U3.T2(~{RESET}) U4.T2(~{RESET}) U5.T2(~{RESET}) U6.T2(~{RESET})
DRAM_SDBA0: R56.1 U1.AC15(DRAM_SDBA0) U3.M2(BA0) U4.M2(BA0) U5.M2(BA0) U6.M2(BA0)
DRAM_SDBA1: R57.1 U1.Y15(DRAM_SDBA1) U3.N8(BA1) U4.N8(BA1) U5.N8(BA1) U6.N8(BA1)
DRAM_SDBA2: R58.1 U1.AB12(DRAM_SDBA2) U3.M3(BA2) U4.M3(BA2) U5.M3(BA2) U6.M3(BA2)
DRAM_SDCKE0: R31.2 R65.1 U1.Y11(DRAM_SDCKE0) U3.K9(CKE) U4.K9(CKE) U5.K9(CKE) U6.K9(CKE)
DRAM_SDODT0: R66.1 U1.AC16(DRAM_SDODT0) U3.K1(ODT) U4.K1(ODT) U5.K1(ODT) U6.K1(ODT)
DRAM_WE_B: R63.1 U1.AB16(DRAM_SDWE) U3.L3(~{WE}) U4.L3(~{WE}) U5.L3(~{WE}) U6.L3(~{WE})
ZQPAD: R35.2 U1.AE17(ZQPAD)
NetR27_2: R27.2 U3.L9(NC)
NetR28_2: R28.2 U4.L9(NC)
NetR33_2: R33.2 U5.L9(NC)
NetR34_2: R34.2 U6.L9(NC)

Not connected (* = marked no-connect by the designer): U1 AA11(DRAM_SDCKE1)* AB17(DRAM_SDODT1)* AD17(DRAM_CS1)*; U3 J1(NC)* J9(NC)* L1(NC)*; U4 J1(NC)* J9(NC)* L1(NC)*; U5 J1(NC)* J9(NC)* L1(NC)*; U6 J1(NC)* J9(NC)* L1(NC)*

## Buses and harness runs
bus DRAM_[A0...A15]
bus DRAM_D[63...0]

## Layout directives
net class DRAM_ADDR_CTRL: DRAM_A0, DRAM_A1, DRAM_A2, DRAM_A3, DRAM_A4, DRAM_A5, DRAM_A6, DRAM_A7, DRAM_A8, DRAM_A9, DRAM_A10, DRAM_A11, DRAM_A12, DRAM_A13, DRAM_A14, DRAM_A15, DRAM_CAS_B, DRAM_CS0_B, DRAM_RAS_B, DRAM_RESET_B, DRAM_SDBA0, DRAM_SDBA1, DRAM_SDBA2, DRAM_SDCKE0, DRAM_SDODT0, DRAM_WE_B
net class DRAM_SDCLK: DRAM_CLK0_N, DRAM_CLK0_P, DRAM_CLK1_N, DRAM_CLK1_P
net class DRAM_BANK0: DRAM_D0, DRAM_D1, DRAM_D2, DRAM_D3, DRAM_D4, DRAM_D5, DRAM_D6, DRAM_D7, DRAM_DQM0, DRAM_DQS0_N, DRAM_DQS0_P
net class DRAM_BANK1: DRAM_D8, DRAM_D9, DRAM_D10, DRAM_D11, DRAM_D12, DRAM_D13, DRAM_D14, DRAM_D15, DRAM_DQM1, DRAM_DQS1_N, DRAM_DQS1_P
net class DRAM_BANK2: DRAM_D16, DRAM_D17, DRAM_D18, DRAM_D19, DRAM_D20, DRAM_D21, DRAM_D22, DRAM_D23, DRAM_DQM2, DRAM_DQS2_N, DRAM_DQS2_P
net class DRAM_BANK3: DRAM_D24, DRAM_D25, DRAM_D26, DRAM_D27, DRAM_D28, DRAM_D29, DRAM_D30, DRAM_D31, DRAM_DQM3, DRAM_DQS3_N, DRAM_DQS3_P
net class DRAM_BANK4: DRAM_D32, DRAM_D33, DRAM_D34, DRAM_D35, DRAM_D36, DRAM_D37, DRAM_D38, DRAM_D39, DRAM_DQM4, DRAM_DQS4_N, DRAM_DQS4_P
net class DRAM_BANK5: DRAM_D40, DRAM_D41, DRAM_D42, DRAM_D43, DRAM_D44, DRAM_D45, DRAM_D46, DRAM_D47, DRAM_DQM5, DRAM_DQS5_N, DRAM_DQS5_P
net class DRAM_BANK6: DRAM_D48, DRAM_D49, DRAM_D50, DRAM_D51, DRAM_D52, DRAM_D53, DRAM_D54, DRAM_D55, DRAM_DQM6, DRAM_DQS6_N, DRAM_DQS6_P
net class DRAM_BANK7: DRAM_D56, DRAM_D57, DRAM_D58, DRAM_D59, DRAM_D60, DRAM_D61, DRAM_D62, DRAM_D63, DRAM_DQM7, DRAM_DQS7_N, DRAM_DQS7_P
differential pair; differential pair class DIFF100: DRAM_CLK0_N, DRAM_CLK0_P, DRAM_CLK1_N, DRAM_CLK1_P, DRAM_DQS0_N, DRAM_DQS0_P, DRAM_DQS1_N, DRAM_DQS1_P, DRAM_DQS2_N, DRAM_DQS2_P, DRAM_DQS3_N, DRAM_DQS3_P, DRAM_DQS4_N, DRAM_DQS4_P, DRAM_DQS5_N, DRAM_DQS5_P, DRAM_DQS6_N, DRAM_DQS6_P, DRAM_DQS7_N, DRAM_DQS7_P

## Notes on the sheet
- DRAM
- DESIGN NOTE:
  DRAM_SDCKE0 no longer requires external 10 kΩ resistors to GND to minimize current drain during deep sleep mode (DSM).
  We keep the option to stay compatible with old CPU revisions.
- Design note :
  Unused
- Adress, control and command termination. Place at the end of the signal.
- Design note :
  Decoupling capacitors for SDRAM
- (in symbol DDR3) ADRESS; DATA; 4GB_DDR3_SDRAM_256MX16; ???
- (in symbol IMX6Q5EYM10AE, part B) IMX6 DRAM
- (in symbol Title bloc ANSI) APPROVAL; DATE; Designer :; LOGO; Drawn by :; PROJECT TITLE :; Checked by :; DWG TITLE :; PAGE TITLE :; Approved by :; Document number :; REV; SIZE; SHEET; OF

## Library data of the parts
C105-C120 C129-C148 C150-C175 = cap 0.22µ 10V: cap cer 0.22µ 10V 10% X5R 0402; Diélectrique: X5R
C121-C128 = cap 22µ 10V: cap cer 22µ 10V 10% X5R 0603; Diélectrique: X5R
C149 C176 = cap 0.1µ 16V: cap solid electrolyte 0.1µ 6.3V 10%; Diélectrique: X7R
R27-R30 R33-R37 = res 240 1%: res 240 1% 0402
R31 R32 = res 10k 1%: res 10k 1% 0402
R38-R66 = res 49R9 1%: res 49R9 ohm 1% 0402
TB5 = Title bloc ANSI
U1 = IMX6Q5EYM10AE: 32-Bit i.MX 6 Quad Application Processor, 1 GHz, 256 KB RAM, Extended Consumer Grade, 624-Pin FCPBGA, RoHS, Tape and Reel; PartNumber: MCIMX6Q5EYM10ACR; Manufacturer: Freescale Semiconductor; CAN: FlexCAN; Number of Cores: 4 Spec; External Memory Supported: DDR3, DDR3L, FLASH, LPDDR2; Speed Grade: 1 GHz; Core Type: ARM Cortex A9; Cache (KB): 32; Ethernet: 1 Gbps + IEEE 1588; Internal RAM (KB): 256; ComponentLink1Description: Manufacturer URL; ComponentLink2Description: Datasheet; DatasheetVersion: Rev. 2.3; ComponentLink3URL: http://cache.freescale.com/files/32bit/doc/data_sheet/IMX6DQCEC.pdf?fpsp=1&WT_TYPE=Data%20Sheets&WT_VENDOR=FREESCALE&WT_FILE_FORMAT=pdf&WT_ASSET=Documentation; ComponentLink1URL: http://www.freescale.com/; Packing: Tape and Reel; Temperature Range: -20 to 105 degC; ComponentLink2URL: http://cache.freescale.com/files/32bit/doc/data_sheet/IMX6DQCEC.pdf?fpsp=1&WT_TYPE=Data%20Sheets&WT_VENDOR=FREESCALE&WT_FILE_FORMAT=pdf&WT_ASSET=Documentation; ComponentLink3Description: Package Specification; PackageVersion: Rev. A; RoHS: TRUE; Quad/Dual CPU: i.MX 6Quad; Mounting Technology: Surface Mount; PackageReference: FCPBGA-624; PackageDescription: 624-pin Ball Grid Array Package, Body 21 x 21mm, Pitch 0.8mm
U3-U6 = DDR3: DDR3 4Gbx4